# Altium project magicGlovePCB.PrjPcb
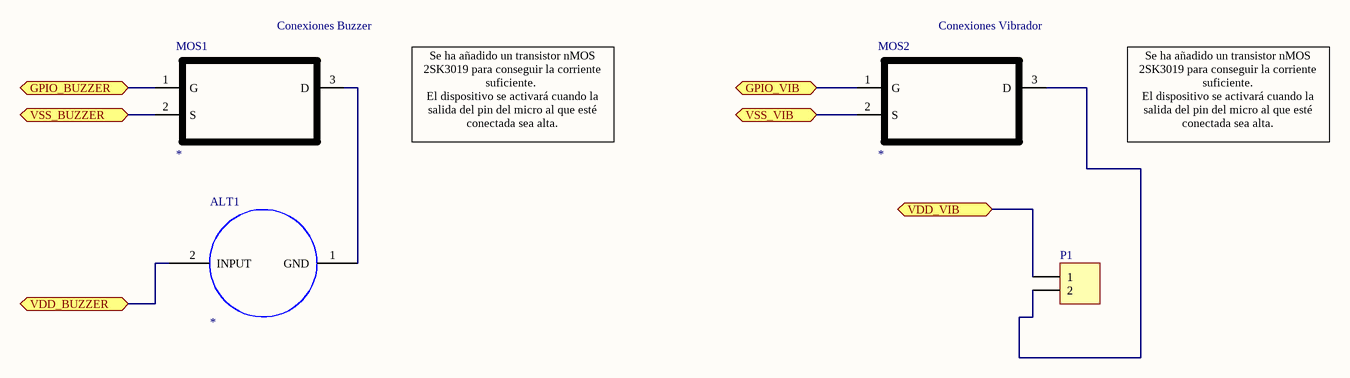
[diagram p0: Actuadores.SchDoc]
5 sheets, 56 parts. Net scope: flat (ports and power ports of the same name join across sheets).
Board files: magicGlove.PcbDoc, Modulo Bluetooth.PcbDoc
Sheets:
  Actuadores.SchDoc
  AT short bus ( 7 x 4.8 inches).schdoc
  PuertosSensores.SchDoc
  Sensores.SchDoc
  uProcesador.SchDoc

## Sheet Actuadores.SchDoc
size A4

### Parts
ALT1  *  [Buzzer]
MOS1  *  [SOT-523]
MOS2  *  [SOT-523]
P1  (no value)  [HDR1X2]

### Ports
GPIO_BUZZER, GPIO_VIB, VDD_BUZZER, VDD_VIB, VSS_BUZZER, VSS_VIB

### Nets
AGND: MOS1.2(S) MOS2.2(S) ; port VSS_BUZZER, port VSS_VIB
AVCC: ALT1.2(INPUT) P1.1 ; port VDD_BUZZER, port VDD_VIB
P8.1: MOS1.1(G) ; port GPIO_BUZZER
P8.2: MOS2.1(G) ; port GPIO_VIB
NetALT1_1: ALT1.1(GND) MOS1.3(D)
NetMOS2_3: MOS2.3(D) P1.2

### Notes on the sheet
- Conexiones Buzzer
- Conexiones Vibrador
- Se ha añadido un transistor nMOS 2SK3019 para conseguir la corriente suficiente.
  El dispositivo se activará cuando la salida del pin del micro al que esté conectada sea alta.

### Library data of the parts
ALT1 = ABT-407
MOS1 MOS2 = MOSFETN
P1 = Header 2: Header, 2-Pin; LatestRevisionDate: 17-Jul-2002; LatestRevisionNote: Re-released for DXP Platform.; Publisher: Altium Limited

## Sheet AT short bus ( 7 x 4.8 inches).schdoc: AT short bus ( 7 x 4.8 inches)
size A; Organization: Organization; Address1: Address1; Address2: Address2; Address3: Address3; Address4: Address4; DocumentNumber: 1; Revision: 0; SheetNumber: 2; SheetTotal: 2
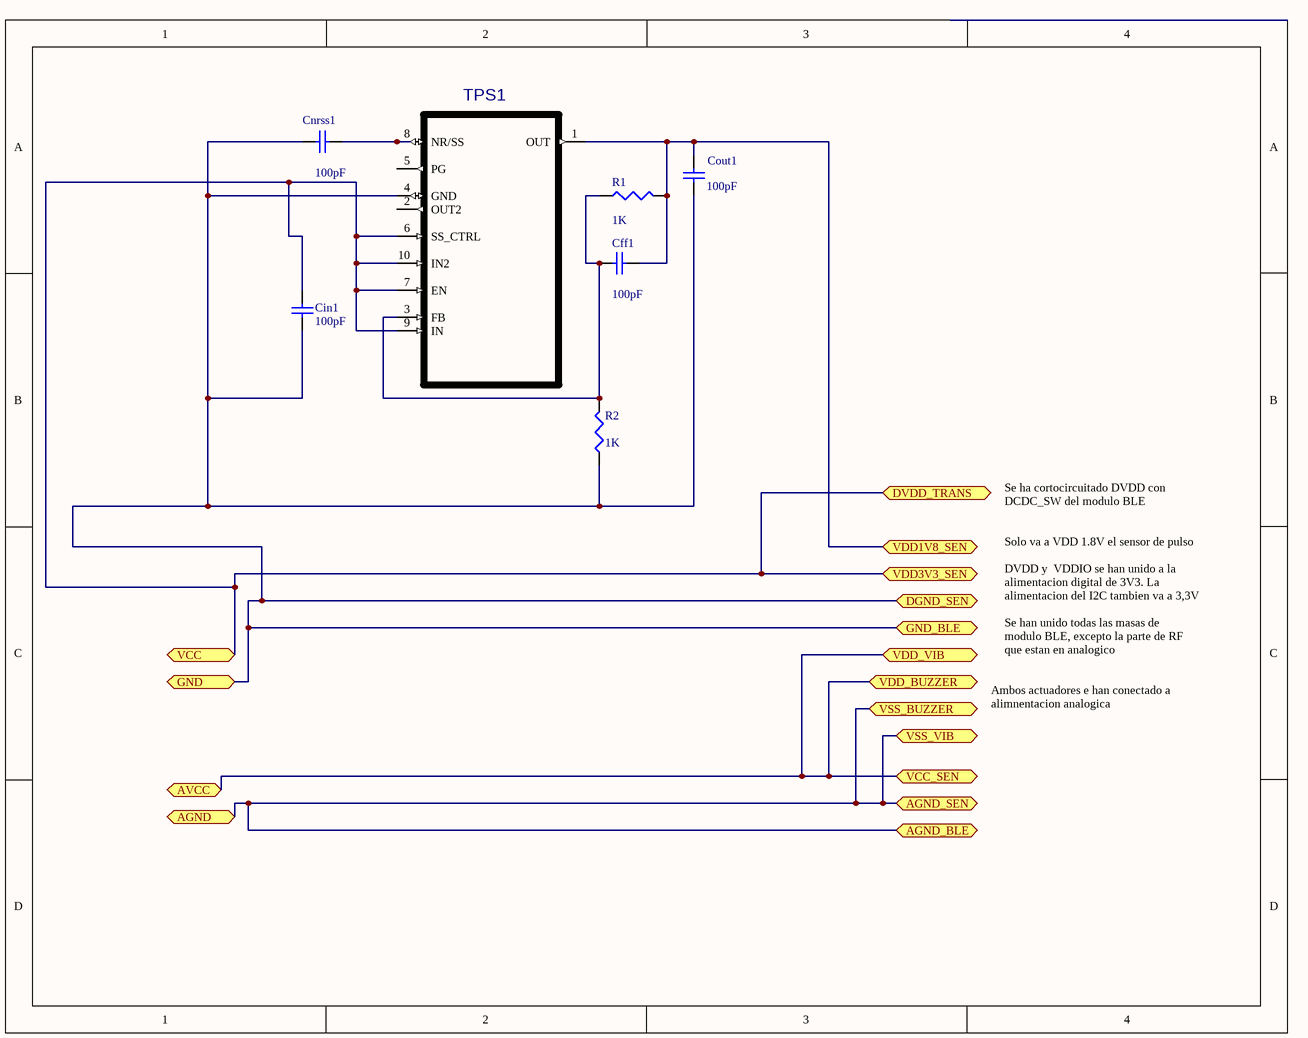
[diagram p1: AT short bus ( 7 x 4.8 inches).schdoc]

### Parts
Cff1  value 100pF  [C1206]
Cin1  value 100pF  [C1206]
Cnrss1  value 100pF  [C1206]
Cout1  value 100pF  [C1206]
R1  value 1K  [J1-0603]
R2  value 1K  [J1-0603]
TPS1  TPS63030DSKT  [SON50P260X260X80-11N]  (value not drawn)

### Ports
AGND, AGND_BLE, AGND_SEN, AVCC, DGND_SEN, DVDD_TRANS, GND (bidir), GND_BLE, VCC, VCC_SEN, VDD1V8_SEN, VDD3V3_SEN, VDD_BUZZER, VDD_VIB, VSS_BUZZER, VSS_VIB

### Nets
AGND: port AGND_SEN, port VSS_BUZZER, port VSS_VIB, port AGND, port AGND_BLE
AVCC: port VCC_SEN, port VDD_BUZZER, port VDD_VIB, port AVCC
GND: Cin1.1 Cnrss1.1 Cout1.1 R2.1 TPS1.4(GND) ; port DGND_SEN, port GND, port GND_BLE
VCC: Cin1.2 TPS1.6(SS_CTRL) TPS1.7(EN) TPS1.9(IN) TPS1.10(IN2) ; port VDD3V3_SEN, port VCC, port DVDD_TRANS
NetC24_1: Cff1.2 Cout1.2 R1.2 TPS1.1(OUT) ; port VDD1V8_SEN
NetCff1_1: Cff1.1 R1.1 R2.2 TPS1.3(FB)
NetCnrss1_2: Cnrss1.2 TPS1.8(NR/SS)

Not connected (* = marked no-connect by the designer): TPS1 2(OUT2) 5(PG) 11(THERMALPAD)

### Notes on the sheet
- Se ha cortocircuitado DVDD con DCDC_SW del modulo BLE
- Solo va a VDD 1.8V el sensor de pulso
- DVDD y  VDDIO se han unido a la alimentacion digital de 3V3. La alimentacion del I2C tambien va a 3,3V
- Se han unido todas las masas de modulo BLE, excepto la parte de RF que estan en analogico
- Ambos actuadores e han conectado a alimnentacion analogica
  AAmbosAmboe ha cortocircuitado DVDD con DCDC_SW del modulo BLE

### Library data of the parts
Cff1 Cin1 Cnrss1 Cout1 = Cap Semi: Capacitor (Semiconductor SIM Model); Published: 8-Jun-2000; LatestRevisionDate: 29-May-2009; LatestRevisionNote: IPC-7351 Footprint Added.; PackageReference: C1206; Publisher: Altium Limited; PackageDescription: Chip Capacitor
R1 R2 = Res3: Resistor; Published: 8-Jun-2000; LatestRevisionDate: 29-May-2009; LatestRevisionNote: IPC-7351 Footprint Added.; PackageReference: J1-0603; Publisher: Altium Limited; PackageDescription: Chip Resistor
TPS1 = TPS63030DSKT: TPS7A91 (ACTIVE)  1-A, High Accuracy, Low Noise LDO Voltage Regulator; MF: Texas Instruments; MP: TPS63030DSKT; Price: 1.51 USD; Package: WSON-10 Texas Instruments; Availability: Good; Value: *

## Sheet PuertosSensores.SchDoc
size A4
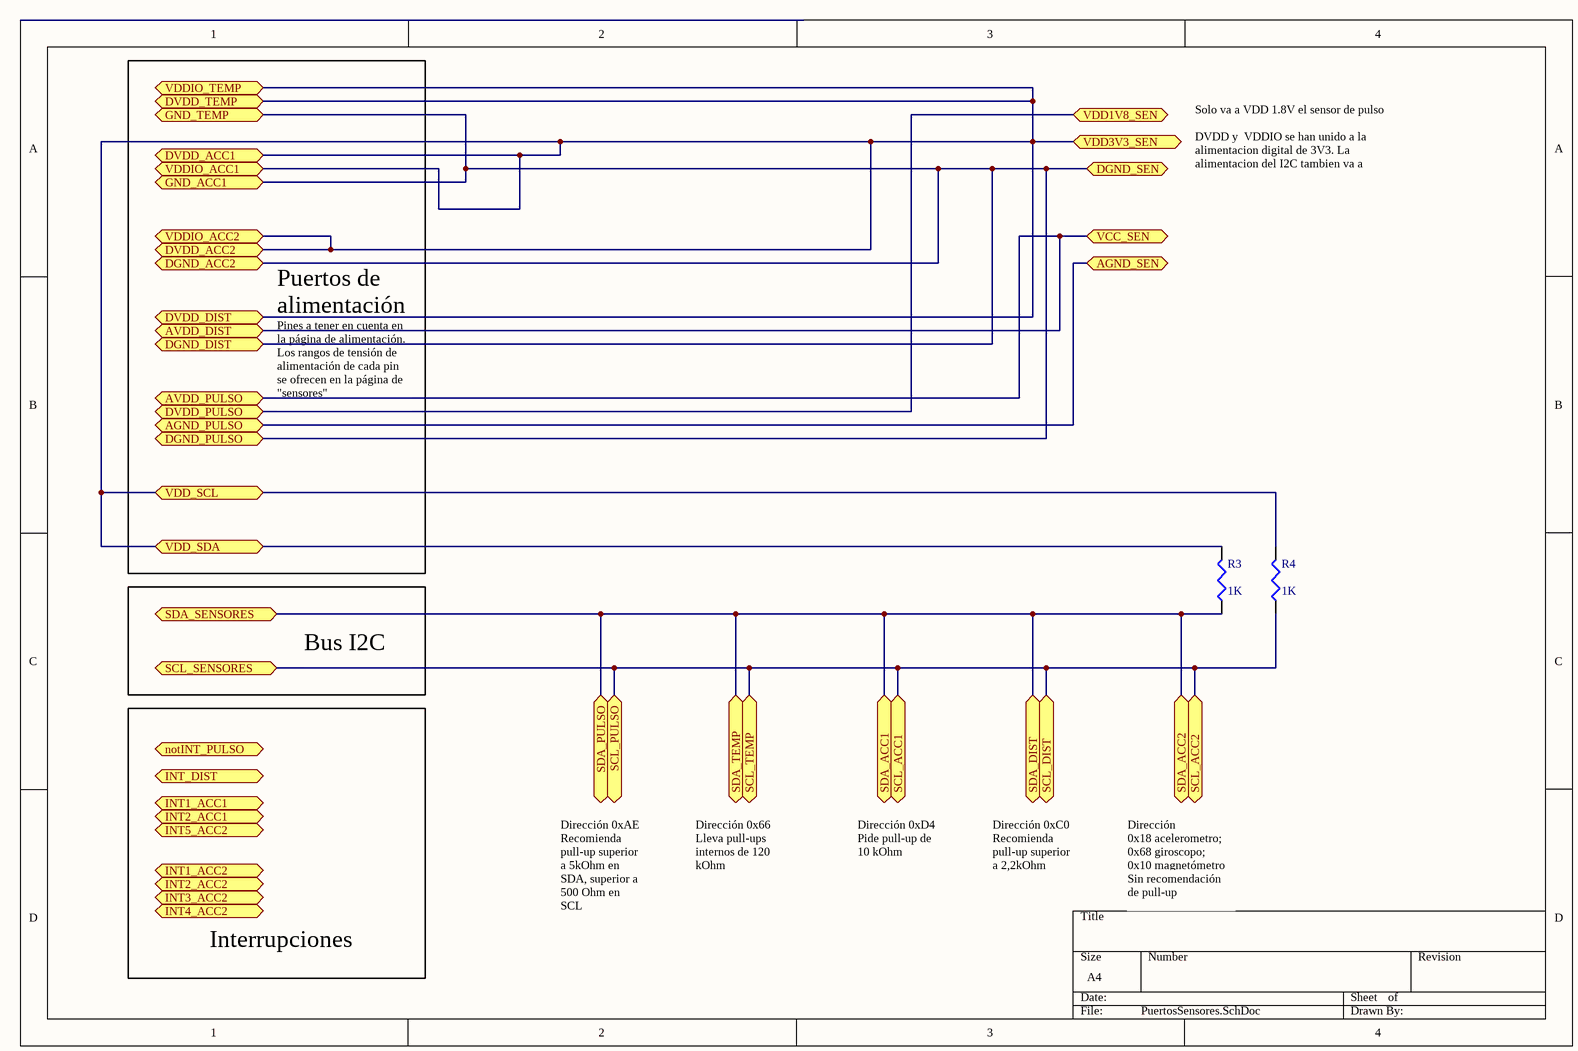
[diagram p2: PuertosSensores.SchDoc]

### Parts
R3  value 1K  [J1-0603]
R4  value 1K  [J1-0603]

### Ports
AGND_PULSO, AGND_SEN, AVDD_DIST, AVDD_PULSO, DGND_ACC2, DGND_DIST, DGND_PULSO, DGND_SEN, DVDD_ACC1, DVDD_ACC2, DVDD_DIST, DVDD_PULSO, DVDD_TEMP, GND_ACC1, GND_TEMP, INT1_ACC1, INT1_ACC2, INT2_ACC1, INT2_ACC2, INT3_ACC2, INT4_ACC2, INT5_ACC2, INT_DIST, notINT_PULSO, SCL_ACC1, SCL_ACC2, SCL_DIST, SCL_PULSO, SCL_SENSORES, SCL_TEMP, SDA_ACC1, SDA_ACC2, SDA_DIST, SDA_PULSO, SDA_SENSORES, SDA_TEMP, VCC_SEN, VDD1V8_SEN, VDD3V3_SEN, VDD_SCL, VDD_SDA, VDDIO_ACC1, VDDIO_ACC2, VDDIO_TEMP

### Nets
AGND: port AGND_PULSO, port AGND_SEN
AVCC: port AVDD_PULSO, port AVDD_DIST, port VCC_SEN
GND: port GND_TEMP, port DGND_PULSO, port DGND_DIST, port GND_ACC1, port DGND_ACC2, port DGND_SEN
VCC: R3.2 R4.2 ; port VDD_SCL, port VDD_SDA, port DVDD_TEMP, port VDDIO_TEMP, port DVDD_DIST, port DVDD_ACC1, port VDDIO_ACC1, port DVDD_ACC2, port VDDIO_ACC2, port VDD3V3_SEN
P4.1: R3.1 ; port SDA_SENSORES, port SDA_TEMP, port SDA_PULSO, port SDA_DIST, port SDA_ACC1, port SDA_ACC2
P4.2: R4.1 ; port SCL_SENSORES, port SCL_TEMP, port SCL_PULSO, port SCL_DIST, port SCL_ACC1, port SCL_ACC2
NetC24_1: port DVDD_PULSO, port VDD1V8_SEN

### Notes on the sheet
- Solo va a VDD 1.8V el sensor de pulso
- DVDD y  VDDIO se han unido a la alimentacion digital de 3V3. La alimentacion del I2C tambien va a 3,3V
- Puertos de alimentación
- Pines a tener en cuenta en la página de alimentación. Los rangos de tensión de alimentación de cada pin se ofrecen en la página de "sensores"
- Bus I2C
- Dirección 0xAE
- Dirección 0x66
- Dirección 0xD4
- Recomienda pull-up superior a 2,2kOhm
- Dirección 0xC0
- Dirección
  0x18 acelerometro;
  0x68 giroscopo;
  0x10 magnetómetro
- Recomienda pull-up superior a 5kOhm en SDA, superior a 500 Ohm en SCL
- Lleva pull-ups internos de 120 kOhm
- Pide pull-up de 10 kOhm
- Sin recomendación de pull-up
- Interrupciones

### Library data of the parts
R3 R4 = Res3: Resistor; Published: 8-Jun-2000; LatestRevisionDate: 29-May-2009; LatestRevisionNote: IPC-7351 Footprint Added.; PackageReference: J1-0603; Publisher: Altium Limited; PackageDescription: Chip Resistor

## Sheet Sensores.SchDoc
size A4
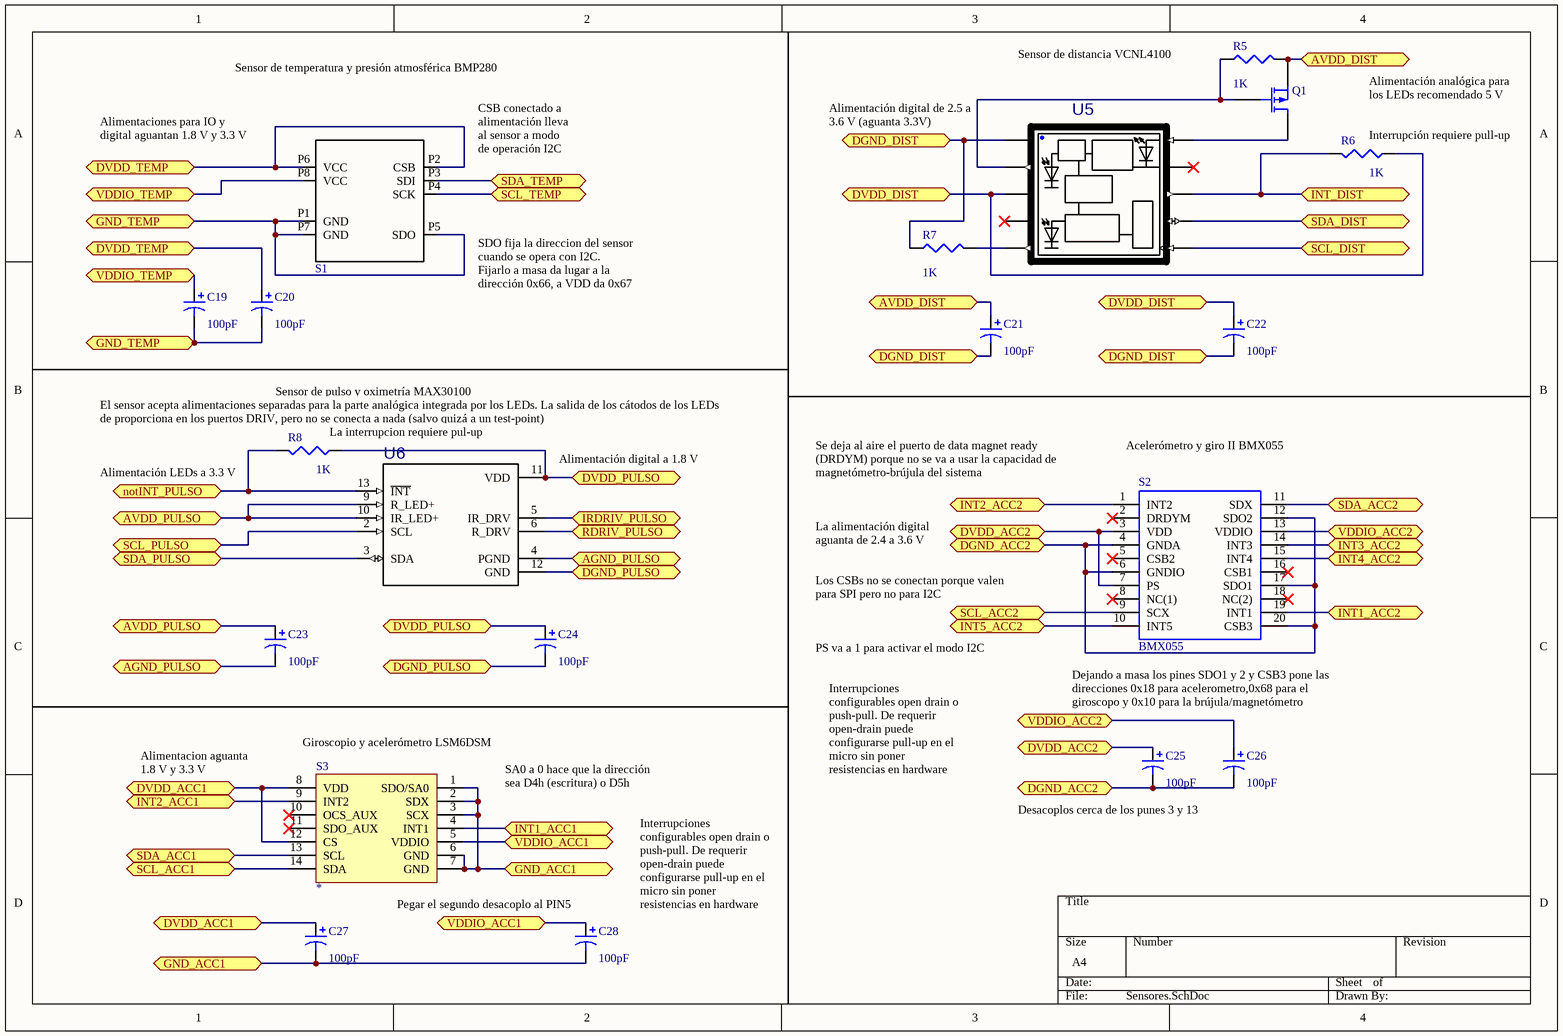
[diagram p3: Sensores.SchDoc]

### Parts
C19  value 100pF  [C0805]
C20  value 100pF  [C0805]
C21  value 100pF  [C0805]
C22  value 100pF  [C0805]
C23  value 100pF  [C0805]
C24  value 100pF  [C0805]
C25  value 100pF  [C0805]
C26  value 100pF  [C0805]
C27  value 100pF  [C0805]
C28  value 100pF  [C0805]
Q1  (no value)  [E3]
R5  value 1K  [J1-0603]
R6  value 1K  [J1-0603]
R7  value 1K  [J1-0603]
R8  value 1K  [J1-0603]
S1  *  [LGA-8_BMP280(Primary)]  (value not drawn)
S2  BMX055  [LGA_PACKAGE_20_PINS]
S3  *  [LGA14R50P5X4_300X250X83]
U5  VCNL4100  [VISHAY_VCNL4100_8X3X1.8]  (value not drawn)
U6  MAX30100EFD+  [LGA14R80P2X7_560X280X130]  (value not drawn)

### Ports
AGND_PULSO, AVDD_DIST, AVDD_PULSO, DGND_ACC2, DGND_DIST, DGND_PULSO, DVDD_ACC1, DVDD_ACC2, DVDD_DIST, DVDD_PULSO, DVDD_TEMP, GND_ACC1, GND_TEMP, INT1_ACC1, INT1_ACC2, INT2_ACC1, INT2_ACC2, INT3_ACC2, INT4_ACC2, INT5_ACC2, INT_DIST, IRDRIV_PULSO, notINT_PULSO, RDRIV_PULSO, SCL_ACC1, SCL_ACC2, SCL_DIST, SCL_PULSO, SCL_TEMP, SDA_ACC1, SDA_ACC2, SDA_DIST, SDA_PULSO, SDA_TEMP, VDDIO_ACC1, VDDIO_ACC2, VDDIO_TEMP

### Nets
AGND: C23.2 U6.4(PGND) ; port AGND_PULSO
AVCC: C21.1 C23.1 Q1.3(S) R5.2 U6.9(R_LED+) U6.10(IR_LED+) ; port AVDD_PULSO, port AVDD_DIST
GND: C19.2 C20.2 C21.2 C22.2 C24.2 C25.2 C26.2 C27.2 C28.2 R7.1 S1.P1(GND) S1.P5(SDO) S1.P7(GND) S2.4(GNDA) S2.6(GNDIO) S2.12(SDO2) S2.17(SDO1) S2.20(CSB3) S3.1(SDO/SA0) S3.2(SDX) S3.3(SCX) S3.6(GND) S3.7(GND) U5.1(GND) U6.12(GND) ; port GND_TEMP, port DGND_PULSO, port DGND_DIST, port GND_ACC1, port DGND_ACC2
VCC: C19.1 C20.1 C22.1 C25.1 C26.1 C27.1 C28.1 R6.1 S1.P2(CSB) S1.P6(VCC) S1.P8(VCC) S2.3(VDD) S2.7(PS) S2.13(VDDIO) S3.5(VDDIO) S3.8(VDD) S3.12(CS) U5.3(VDD) ; port VDDIO_TEMP, port DVDD_TEMP, port DVDD_DIST, port DVDD_ACC1, port VDDIO_ACC1, port DVDD_ACC2, port VDDIO_ACC2
P1.6: R8.2 U6.13(~{INT}) ; port notINT_PULSO
P1.7: R6.2 U5.8(INT) ; port INT_DIST
P2.0: S3.4(INT1) ; port INT1_ACC1
P2.1: S3.9(INT2) ; port INT2_ACC1
P2.2: S2.10(INT5) ; port INT5_ACC2
P2.3: S2.19(INT1) ; port INT1_ACC2
P2.4: S2.1(INT2) ; port INT2_ACC2
P2.5: S2.14(INT3) ; port INT3_ACC2
P2.6: S2.15(INT4) ; port INT4_ACC2
P4.1: S1.P3(SDI) S2.11(SDX) S3.13(SCL) U5.9(SDAT) U6.3(SDA) ; port SDA_TEMP, port SDA_PULSO, port SDA_DIST, port SDA_ACC1, port SDA_ACC2
P4.2: S1.P4(SCK) S2.9(SCX) S3.14(SDA) U5.10(SCLK) U6.2(SCL) ; port SCL_TEMP, port SCL_PULSO, port SCL_DIST, port SCL_ACC1, port SCL_ACC2
NetC24_1: C24.1 R8.1 U6.11(VDD) ; port DVDD_PULSO
NetQ1_1: Q1.1(D) U5.6(LED+)
NetQ1_2: Q1.2(G) R5.1 U5.2(LED-C)
NetR7_2: R7.2 U5.5(LED-)
NetU6_5: U6.5(IR_DRV) ; port IRDRIV_PULSO
NetU6_6: U6.6(R_DRV) ; port RDRIV_PULSO

Not connected (* = marked no-connect by the designer): S2 2(DRDYM)* 5(CSB2)* 8(NC(1))* 16(CSB1)* 18(NC(2))*; S3 10(OCS_AUX)* 11(SDO_AUX)*; U5 4(NC)* 7(NC2)*

### Notes on the sheet
- Sensor de temperatura y presión atmosférica BMP280
- (near R5) Sensor de distancia VCNL4100
- Alimentación analógica para los LEDs recomendado 5 V
- Alimentaciones para IO y digital aguantan 1.8 V y 3.3 V
- CSB conectado a alimentación lleva al sensor a modo de operación I2C
- Alimentación digital de 2.5 a 3.6 V (aguanta 3.3V)
- (near R6) Interrupción requiere pull-up
- SDO fija la direccion del sensor cuando se opera con I2C.
  Fijarlo a masa da lugar a la dirección 0x66, a VDD da 0x67
- (near R8) El sensor acepta alimentaciones separadas para la parte analógica integrada por los LEDs. La salida de los cátodos de los LEDs de proporciona en los puertos DRIV, pero no se conecta a nada (salvo quizá a un test-point)
- Sensor de pulso y oximetría MAX30100
- (near R8) La interrupcion requiere pul-up
- Acelerómetro y giro II BMX055
- (near R8) Alimentación LEDs a 3.3 V
- (near U6) Alimentación digital a 1.8 V
- Se deja al aire el puerto de data magnet ready (DRDYM) porque no se va a usar la capacidad de magnetómetro-brújula del sistema
- La alimentación digital aguanta de 2.4 a 3.6 V
- Los CSBs no se conectan porque valen para SPI pero no para I2C
- PS va a 1 para activar el modo I2C
- Dejando a masa los pines SDO1 y 2 y CSB3 pone las direcciones 0x18 para acelerometro,0x68 para el giroscopo y 0x10 para la brújula/magnetómetro
- Alimentacion aguanta 1.8 V y 3.3 V
- (near S3) Giroscopio y acelerómetro LSM6DSM
- SA0 a 0 hace que la dirección sea D4h (escritura) o D5h (lectura)
- Interrupciones configurables open drain o push-pull. De requerir open-drain puede configurarse pull-up en el micro sin poner resistencias en hardware
- Desacoplos cerca de los punes 3 y 13
- (near C28) Pegar el segundo desacoplo al PIN5

### Library data of the parts
C19-C28 = Cap Pol3: Polarized Capacitor (Surface Mount); Published: 8-Jun-2000; LatestRevisionDate: 29-May-2009; LatestRevisionNote: IPC-7351 Footprint Added.; PackageReference: C0805; Publisher: Altium Limited; PackageDescription: Chip Capacitor
Q1 = MOSFET-P: P-Channel MOSFET; Published: 8-Jun-2000; LatestRevisionDate: 17-Jul-2002; LatestRevisionNote: Re-released for DXP Platform.; PackageVersion: 1995/1996; PackageReference: E3; Publisher: Altium Limited; PackageDescription: TO, Flat Index; 3 In-Line, Axial Leads; Body Dia. 4.6mm; Lead Dia. 0.5 mm (max)
R5-R8 = Res3: Resistor; Published: 8-Jun-2000; LatestRevisionDate: 29-May-2009; LatestRevisionNote: IPC-7351 Footprint Added.; PackageReference: J1-0603; Publisher: Altium Limited; PackageDescription: Chip Resistor
S1 = BMP280: BMP280 Absolute Barometric Pressure Sensor for Battery Powered Devices 2 x 2.5mm; MF: Bosch; MP: BMP280; Price: 2.16 USD; Package: None; Availability: Good; Value: *
S2 = BMX055: Small versatile 9-axis sensor module; Manufacturer_Name: Bosch Sensortec; Supplier_Name: RS; RS Part Number: *; Manufacturer_Part_Number: BMX055; Datasheet Link: http://www.mouser.com/ds/2/621/BST-BMX055-DS000-02-586421.pdf; Height: mm; Allied_Number: *; 3D Package: *; Other Part Number: *
S3 = LSM6DSMTR: Small versatile 6-axis acc&gyro
U5 = VCNL4100: High Sensitivity Long Distance Proximity Sensor. Dimensions (L x W x H in mm): 8; MF: Vishay; Availability: Good; MP: VCNL4100; Price: 3.52 USD; Package: None; Value: *
U6 = MAX30100EFD+: Pulse Oximeter and Heart-Rate Sensor IC 14-Pin OLGA; MF: Maxim Integrated; Availability: Good; MP: MAX30100EFD+; Price: 4.00 USD; Package: None; Value: *

## Sheet uProcesador.SchDoc
size A4
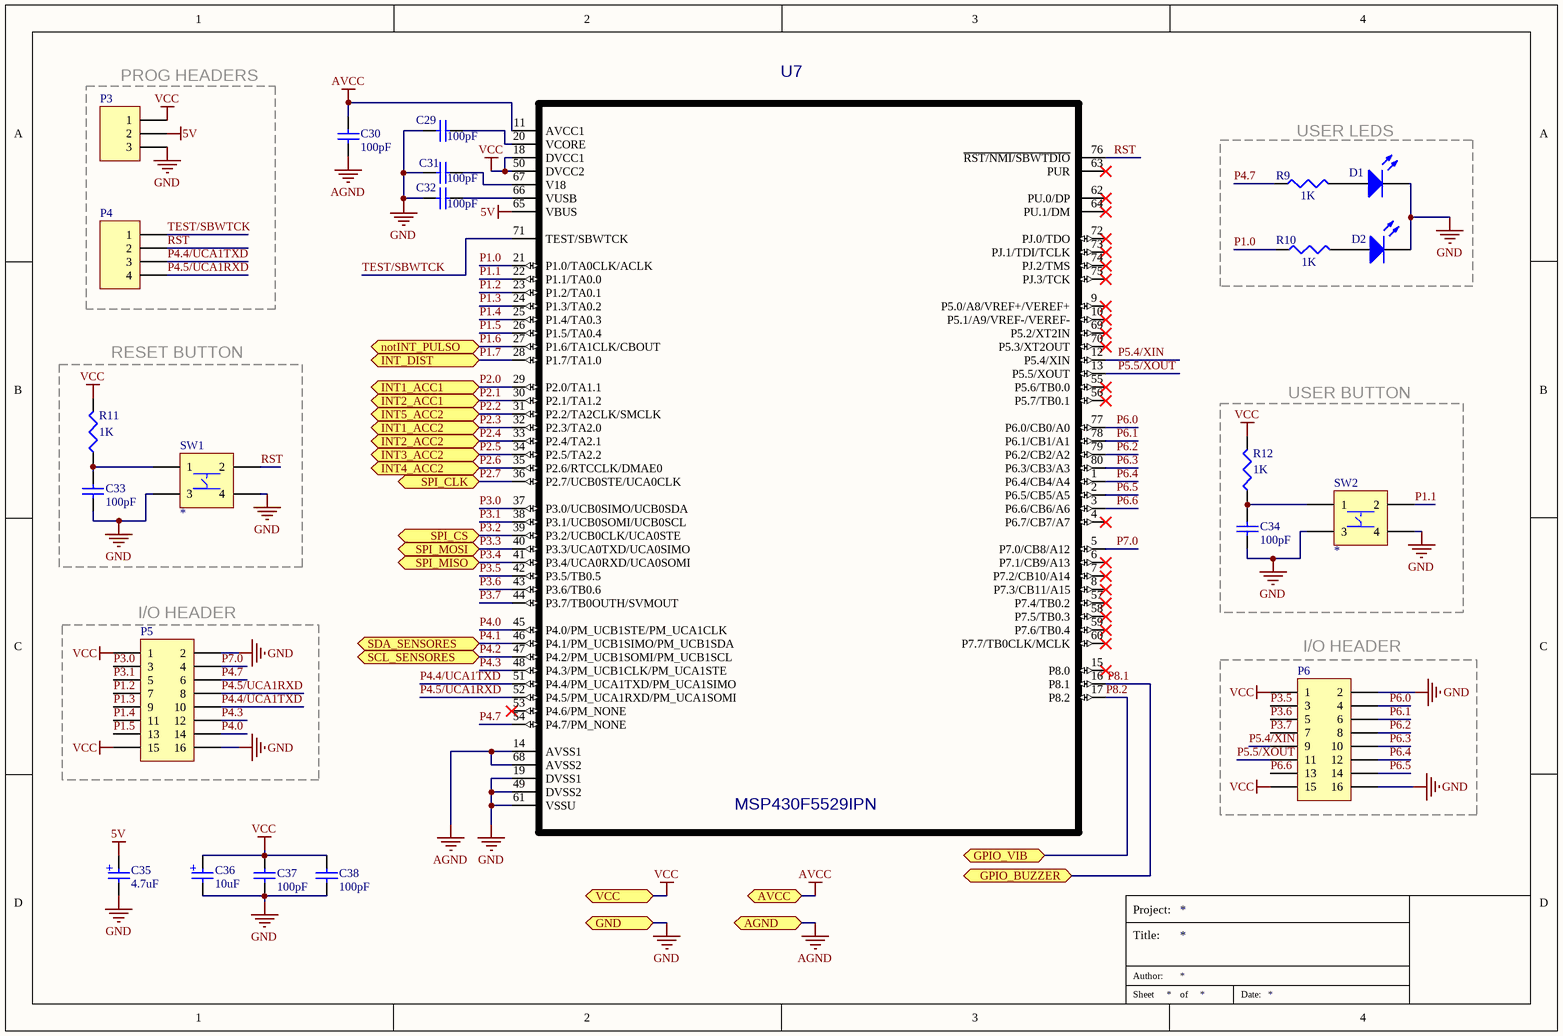
[diagram p4: uProcesador.SchDoc]

### Parts
C29  value 100pF  [C1206]
C30  value 100pF  [C1206]
C31  value 100pF  [C1206]
C32  value 100pF  [C1206]
C33  value 100pF  [C1206]
C34  value 100pF  [C1206]
C35  value 4.7uF  [Cap Pol]
C36  value 10uF  [Cap Pol]
C37  value 100pF  [C1206]
C38  value 100pF  [C1206]
D1  (no value)  [3.2X1.6X1.1]
D2  (no value)  [3.2X1.6X1.1]
P3  (no value)  [HDR1X3]
P4  (no value)  [HDR1X4]
P5  (no value)  [HDR2X8]
P6  (no value)  [HDR2X8]
R9  value 1K  [J1-0603]
R10  value 1K  [J1-0603]
R11  value 1K  [J1-0603]
R12  value 1K  [J1-0603]
SW1  *  [CKN9085CT]
SW2  *  [CKN9085CT]
U7  MSP430F5529IPN  [QFP50P1400X1400X160-80N]

### Ports
AGND, AVCC, GND, GPIO_BUZZER, GPIO_VIB, INT1_ACC1, INT1_ACC2, INT2_ACC1, INT2_ACC2, INT3_ACC2, INT4_ACC2, INT5_ACC2, INT_DIST, notINT_PULSO, SCL_SENSORES, SDA_SENSORES, SPI_CLK, SPI_CS, SPI_MISO, SPI_MOSI, VCC

### Nets
5V: C35.2 P3.2 U7.65(VBUS)
AGND: C30.1 U7.14(AVSS1) U7.68(AVSS2) ; port AGND
AVCC: C30.2 U7.11(AVCC1) ; port AVCC
GND: C29.2 C31.2 C32.2 C33.1 C34.1 C35.1 C36.1 C37.1 C38.1 D1.2(K) D2.2(K) P3.3 P5.2 P5.16 P6.2 P6.16 SW1.3 SW1.4 SW2.3 SW2.4 U7.19(DVSS1) U7.49(DVSS2) U7.61(VSSU) ; port GND
VCC: C36.2 C37.2 C38.2 P3.1 P5.1 P5.15 P6.1 P6.15 R11.2 R12.2 U7.18(DVCC1) U7.50(DVCC2) ; port VCC
P1.0: R10.1 U7.21(P1.0/TA0CLK/ACLK)
P1.1: SW2.2 U7.22(P1.1/TA0.0)
P1.2: P5.7 U7.23(P1.2/TA0.1)
P1.3: P5.9 U7.24(P1.3/TA0.2)
P1.4: P5.11 U7.25(P1.4/TA0.3)
P1.5: P5.13 U7.26(P1.5/TA0.4)
P1.6: U7.27(P1.6/TA1CLK/CBOUT) ; port notINT_PULSO
P1.7: U7.28(P1.7/TA1.0) ; port INT_DIST
P2.0: U7.29(P2.0/TA1.1) ; port INT1_ACC1
P2.1: U7.30(P2.1/TA1.2) ; port INT2_ACC1
P2.2: U7.31(P2.2/TA2CLK/SMCLK) ; port INT5_ACC2
P2.3: U7.32(P2.3/TA2.0) ; port INT1_ACC2
P2.4: U7.33(P2.4/TA2.1) ; port INT2_ACC2
P2.5: U7.34(P2.5/TA2.2) ; port INT3_ACC2
P2.6: U7.35(P2.6/RTCCLK/DMAE0) ; port INT4_ACC2
P2.7: U7.36(P2.7/UCB0STE/UCA0CLK) ; port SPI_CLK
P3.0: P5.3 U7.37(P3.0/UCB0SIMO/UCB0SDA)
P3.1: P5.5 U7.38(P3.1/UCB0SOMI/UCB0SCL)
P3.2: U7.39(P3.2/UCB0CLK/UCA0STE) ; port SPI_CS
P3.3: U7.40(P3.3/UCA0TXD/UCA0SIMO) ; port SPI_MOSI
P3.4: U7.41(P3.4/UCA0RXD/UCA0SOMI) ; port SPI_MISO
P3.5: P6.3 U7.42(P3.5/TB0.5)
P3.6: P6.5 U7.43(P3.6/TB0.6)
P3.7: P6.7 U7.44(P3.7/TB0OUTH/SVMOUT)
P4.0: P5.14 U7.45(P4.0/PM_UCB1STE/PM_UCA1CLK)
P4.1: U7.46(P4.1/PM_UCB1SIMO/PM_UCB1SDA) ; port SDA_SENSORES
P4.2: U7.47(P4.2/PM_UCB1SOMI/PM_UCB1SCL) ; port SCL_SENSORES
P4.3: P5.12 U7.48(P4.3/PM_UCB1CLK/PM_UCA1STE)
P4.4/UCA1TXD: P4.3 P5.10 U7.51(P4.4/PM_UCA1TXD/PM_UCA1SIMO)
P4.5/UCA1RXD: P4.4 P5.8 U7.52(P4.5/PM_UCA1RXD/PM_UCA1SOMI)
P4.7: P5.6 R9.1 U7.54(P4.7/PM_NONE)
P5.4/XIN: P6.9 U7.12(P5.4/XIN)
P5.5/XOUT: P6.11 U7.13(P5.5/XOUT)
P6.0: P6.4 U7.77(P6.0/CB0/A0)
P6.1: P6.6 U7.78(P6.1/CB1/A1)
P6.2: P6.8 U7.79(P6.2/CB2/A2)
P6.3: P6.10 U7.80(P6.3/CB3/A3)
P6.4: P6.12 U7.1(P6.4/CB4/A4)
P6.5: P6.14 U7.2(P6.5/CB5/A5)
P6.6: P6.13 U7.3(P6.6/CB6/A6)
P7.0: P5.4 U7.5(P7.0/CB8/A12)
P8.1: U7.16(P8.1) ; port GPIO_BUZZER
P8.2: U7.17(P8.2) ; port GPIO_VIB
RST: P4.2 SW1.2 U7.76(~{RST/NMI/SBWTDIO})
TEST/SBWTCK: P4.1 U7.71(TEST/SBWTCK)
NetC29_1: C29.1 U7.20(VCORE)
NetC31_1: C31.1 U7.67(V18)
NetC32_1: C32.1 U7.66(VUSB)
NetC33_2: C33.2 R11.1 SW1.1
NetC34_2: C34.2 R12.1 SW2.1
NetD1_1: D1.1(A) R9.2
NetD2_1: D2.1(A) R10.2

Not connected (* = marked no-connect by the designer): U7 4(P6.7/CB7/A7)* 6(P7.1/CB9/A13)* 7(P7.2/CB10/A14)* 8(P7.3/CB11/A15)* 9(P5.0/A8/VREF+/VEREF+)* 10(P5.1/A9/VREF-/VEREF-)* 15(P8.0)* 53(P4.6/PM_NONE)* 55(P5.6/TB0.0)* 56(P5.7/TB0.1)* 57(P7.4/TB0.2)* 58(P7.5/TB0.3)* 59(P7.6/TB0.4)* 60(P7.7/TB0CLK/MCLK)* 62(PU.0/DP)* 63(PUR)* 64(PU.1/DM)* 69(P5.2/XT2IN)* 70(P5.3/XT2OUT)* 72(PJ.0/TDO)* 73(PJ.1/TDI/TCLK)* 74(PJ.2/TMS)* 75(PJ.3/TCK)*

### Notes on the sheet
- (near P3) PROG HEADERS
- USER LEDS
- RESET BUTTON
- USER BUTTON
- (near P5) I/O HEADER
- (near P6) I/O HEADER
- Project:
- Title:
- Sheet
- Author:
- of
- Date:

### Library data of the parts
C29-C34 C37 C38 = Cap Semi: Capacitor (Semiconductor SIM Model); Published: 8-Jun-2000; LatestRevisionDate: 29-May-2009; LatestRevisionNote: IPC-7351 Footprint Added.; PackageReference: C1206; Publisher: Altium Limited; PackageDescription: Chip Capacitor
C35 C36 = Cap Pol: Capacitor pol; Published: 8-Jun-2000; LatestRevisionDate: 29-May-2009; LatestRevisionNote: IPC-7351 Footprint Added.; PackageReference: C1206; Publisher: Altium Limited; PackageDescription: Chip Capacitor
D1 D2 = LED2: Typical RED, GREEN, YELLOW, AMBER GaAs LED; Published: 8-Jun-2000; LatestRevisionDate: 17-Jul-2002; LatestRevisionNote: Re-released for DXP Platform.; PackageVersion: Feb-2002; PackageReference: 3.2X1.6X1.1; Publisher: Altium Limited; PackageDescription: SM LED; 2 Flat Leads
P3 = Header 3: Header, 3-Pin; LatestRevisionDate: 17-Jul-2002; LatestRevisionNote: Re-released for DXP Platform.; Publisher: Altium Limited
P4 = Header 4: Header, 4-Pin; LatestRevisionDate: 17-Jul-2002; LatestRevisionNote: Re-released for DXP Platform.; Publisher: Altium Limited
P5 P6 = Header 8X2: Header, 8-Pin, Dual row; LatestRevisionDate: 17-Jul-2002; LatestRevisionNote: Re-released for DXP Platform.; Publisher: Altium Limited
R9-R12 = Res3: Resistor; Published: 8-Jun-2000; LatestRevisionDate: 29-May-2009; LatestRevisionNote: IPC-7351 Footprint Added.; PackageReference: J1-0603; Publisher: Altium Limited; PackageDescription: Chip Resistor
SW1 SW2 = CKN9085CT
U7 = MSP430F5529IPN: 16-Bit Ultra-Low-Power Microcontroller, 128KB Flash, 8KB RAM, USB, 12Bit ADC, 2 USCIs, 32Bit HW MPY 80-LQFP -40 to 85; MF: Texas Instruments; Price: 6.15 USD; MP: MSP430F5529IPN; Package: LQFP-80 Texas Instruments; Availability: Good; Value: *

## Nets that join several sheets
AGND: Actuadores (MOS1.2 MOS2.2), Sensores (C23.2 U6.4), uProcesador (C30.1 U7.14 U7.68)
AVCC: Actuadores (ALT1.2 P1.1), Sensores (6 pins), uProcesador (C30.2 U7.11)
GND: AT short bus ( 7 x 4.8 inches) (5 pins), Sensores (25 pins), uProcesador (23 pins)
VCC: AT short bus ( 7 x 4.8 inches) (5 pins), PuertosSensores (R3.2 R4.2), Sensores (18 pins), uProcesador (12 pins)
NetC24_1: AT short bus ( 7 x 4.8 inches) (Cff1.2 Cout1.2 R1.2 TPS1.1), Sensores (C24.1 R8.1 U6.11)
P1.6: Sensores (R8.2 U6.13), uProcesador (U7.27)
P1.7: Sensores (R6.2 U5.8), uProcesador (U7.28)
P2.0: Sensores (S3.4), uProcesador (U7.29)
P2.1: Sensores (S3.9), uProcesador (U7.30)
P2.2: Sensores (S2.10), uProcesador (U7.31)
P2.3: Sensores (S2.19), uProcesador (U7.32)
P2.4: Sensores (S2.1), uProcesador (U7.33)
P2.5: Sensores (S2.14), uProcesador (U7.34)
P2.6: Sensores (S2.15), uProcesador (U7.35)
P4.1: PuertosSensores (R3.1), Sensores (5 pins), uProcesador (U7.46)
P4.2: PuertosSensores (R4.1), Sensores (5 pins), uProcesador (U7.47)
P8.1: Actuadores (MOS1.1), uProcesador (U7.16)
P8.2: Actuadores (MOS2.1), uProcesador (U7.17)